# EAGLE schematic MB_MRF24J40MA (EAGLE 6.4)
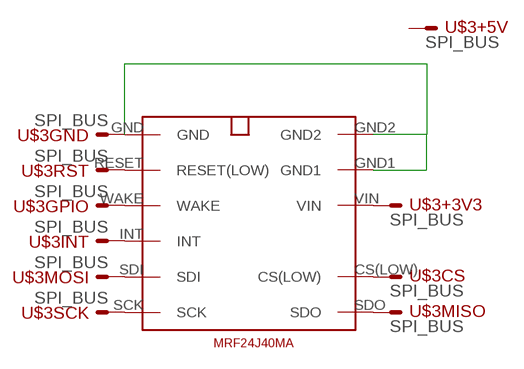
[diagram p0: schematic, sheet 1]

## Parts
U$1  MRF24J40MA  [MRF24J40MA]
U$3  SPI_BUS  [SPI_BUS]

## Nets
N$1: U$1.GND U$1.GND1 U$1.GND2 U$3.GND
N$2: U$1.VIN U$3.+3V3
N$3: U$1.SDI U$3.MOSI
N$4: U$1.SDO U$3.MISO
N$5: U$1.SCK U$3.SCK
N$6: U$1.CS(LOW) U$3.CS
N$7: U$1.INT U$3.INT
N$8: U$1.RESET(RESET(LOW)) U$3.RST
N$9: U$1.WAKE U$3.GPIO
Unconnected: U$3.+5V

## Library data of the parts
U$1 = lieven:MRF24J40MA
U$3 = lieven:SPI_BUS